# EAGLE design Base-Shield-v2 (EAGLE 6.4)
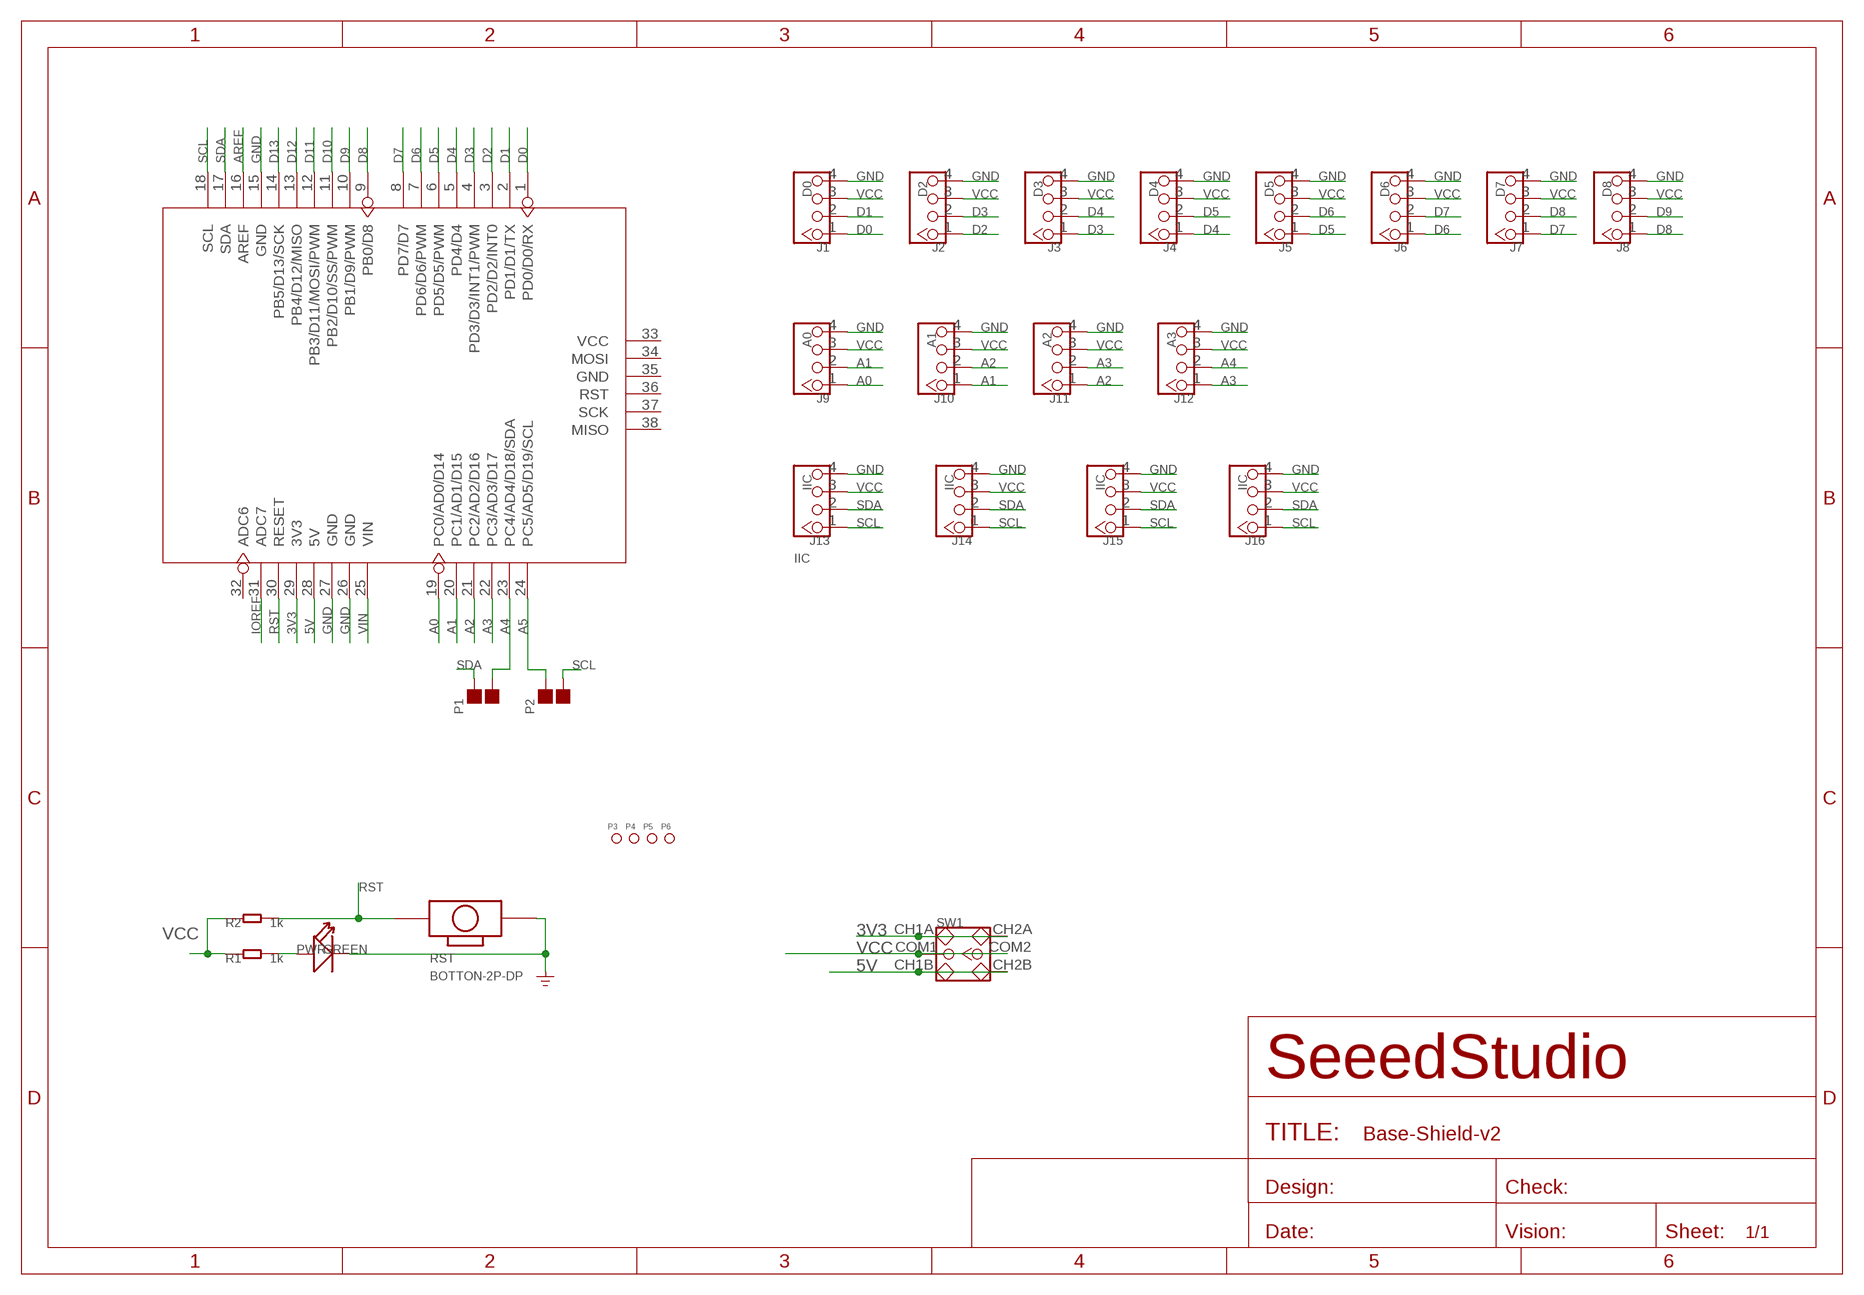
[diagram p0: schematic, sheet 1]

## Parts
J1  D0  TWIG-4P-2.0-2.0  [4P-2.0]
J2  D2  TWIG-4P-2.0-2.0  [4P-2.0]
J3  D3  TWIG-4P-2.0-2.0  [4P-2.0]
J4  D4  TWIG-4P-2.0-2.0  [4P-2.0]
J5  D5  TWIG-4P-2.0-2.0  [4P-2.0]
J6  D6  TWIG-4P-2.0-2.0  [4P-2.0]
J7  D7  TWIG-4P-2.0-2.0  [4P-2.0]
J8  D8  TWIG-4P-2.0-2.0  [4P-2.0]
J9  A0  TWIG-4P-2.0'90D'  [4P-2.0-90D]
J10  A1  TWIG-4P-2.0'90D'  [4P-2.0-90D]
J11  A2  TWIG-4P-2.0'90D'  [4P-2.0-90D]
J12  A3  TWIG-4P-2.0'90D'  [4P-2.0-90D]
J13  IIC  TWIG-4P-2.0-2.0  [4P-2.0]
J14  IIC  TWIG-4P-2.0-2.0  [4P-2.0]
J15  IIC  TWIG-4P-2.0-2.0  [4P-2.0]
J16  IIC  TWIG-4P-2.0-2.0  [4P-2.0]
P1  DNP  PAD-JUMPER-2P  [2P-SMD-1.78X1.27]
P2  DNP  PAD-JUMPER-2P  [2P-SMD-1.78X1.27]
P3  PAD-MARK  [ROUND-MARK-1.0]
P4  PAD-MARK  [ROUND-MARK-1.0]
P5  PAD-MARK  [ROUND-MARK-1.0]
P6  PAD-MARK  [ROUND-MARK-1.0]
PWR  GREEN  LED-3MM  [LED-2P-2.54-3MM]
R1  1k  R-0603  [R0603]
R2  1k  R-0603  [R0603]
RST  BOTTON-2P-DP  BOTTON-2P-90  [2P-7.62X3.56-90D]
SW1  SWITCH-2CH-6P'90D'  [6P-2CH-2.5-9.1X3.5X3.2H-90D]
U2  DIP Long Blue Female Header  ARDUINO-38P  [ARDUINO-38P]

## Nets
3V3: SW1.CH1A SW1.CH2A U2.29(3V3)
5V: SW1.CH1B SW1.CH2B U2.28(5V)
A0: J9.1 U2.19(PC0/AD0/D14)
A1: J9.2 J10.1 U2.20(PC1/AD1/D15)
A2: J10.2 J11.1 U2.21(PC2/AD2/D16)
A3: J11.2 J12.1 U2.22(PC3/AD3/D17)
A4: J12.2 P1.1 U2.23(PC4/AD4/D18/SDA)
A5: P2.2 U2.24(PC5/AD5/D19/SCL)
AREF: U2.16(AREF)
D0: J1.1 U2.1(PD0/D0/RX)
D1: J1.2 U2.2(PD1/D1/TX)
D2: J2.1 U2.3(PD2/D2/INT0)
D3: J2.2 J3.1 U2.4(PD3/D3/INT1/PWM)
D4: J3.2 J4.1 U2.5(PD4/D4)
D5: J4.2 J5.1 U2.6(PD5/D5/PWM)
D6: J5.2 J6.1 U2.7(PD6/D6/PWM)
D7: J6.2 J7.1 U2.8(PD7/D7)
D8: J7.2 J8.1 U2.9(PB0/D8)
D9: J8.2 U2.10(PB1/D9/PWM)
D10: U2.11(PB2/D10/SS/PWM)
D11: U2.12(PB3/D11/MOSI/PWM)
D12: U2.13(PB4/D12/MISO)
D13: U2.14(PB5/D13/SCK)
GND: J1.4 J2.4 J3.4 J4.4 J5.4 J6.4 J7.4 J8.4 J9.4 J10.4 J11.4 J12.4 J13.4 J14.4 J15.4 J16.4 PWR.K(-) RST.P$2 U2.15(GND) U2.26(GND) U2.27(GND)
IOREF: U2.31(ADC7)
N$1: PWR.A(+) R1.2
RST: R2.2 RST.P$1 U2.30(RESET)
SCL: J13.1 J14.1 J15.1 J16.1 P2.1 U2.18(SCL)
SDA: J13.2 J14.2 J15.2 J16.2 P1.2 U2.17(SDA)
VCC: J1.3 J2.3 J3.3 J4.3 J5.3 J6.3 J7.3 J8.3 J9.3 J10.3 J11.3 J12.3 J13.3 J14.3 J15.3 J16.3 R1.1 R2.1 SW1.COM1 SW1.COM2
VIN: U2.25(VIN)
Unconnected: U2.32(ADC6) U2.33(VCC) U2.34(MOSI) U2.35(GND) U2.36(RST) U2.37(SCK) U2.38(MISO)

## Notes on the sheet
- IIC

## Library data of the parts
J1-J16 = Connector:TWIG-4P-2.0
P1 P2 = Discrete:PAD-JUMPER-2P; PARTNO: DNP
P3-P6 = Discrete:PAD-MARK; PARTNO: DNP
PWR = Discrete:LED*
R1 R2 = Discrete:R*
RST = Discrete:BOTTON-2P
SW1 = Discrete:SWITCH-2CH-6P
U2 = moudle:ARDUINO-38P

## Net classes
0 default: width 0.203 mm, drill 0.305 mm, clearance 0.152 mm
3 usbvcc: width 0.203 mm, drill 0.305 mm, clearance 0.203 mm

## Board
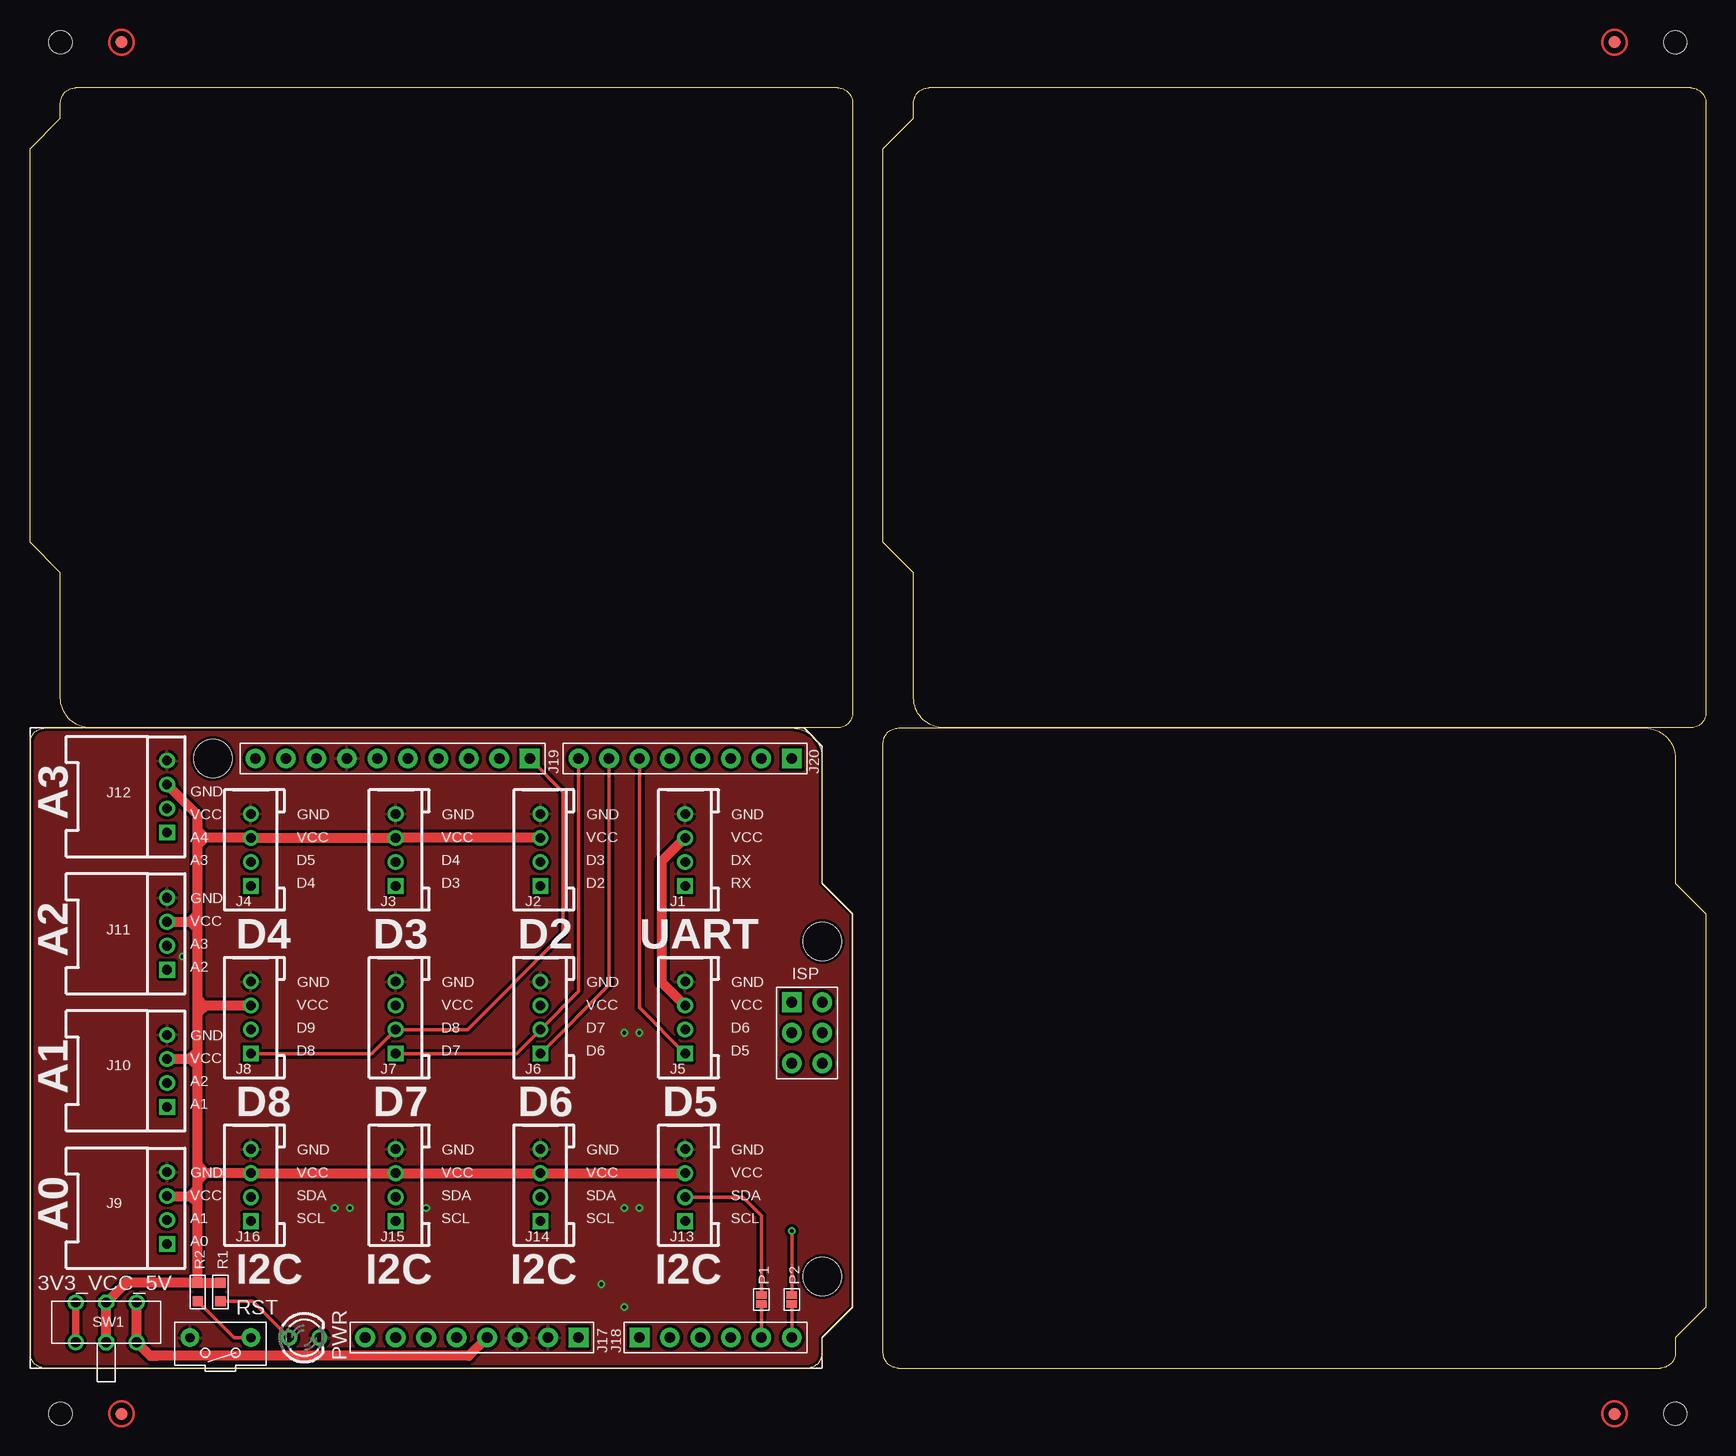
[diagram p1: board, top side]
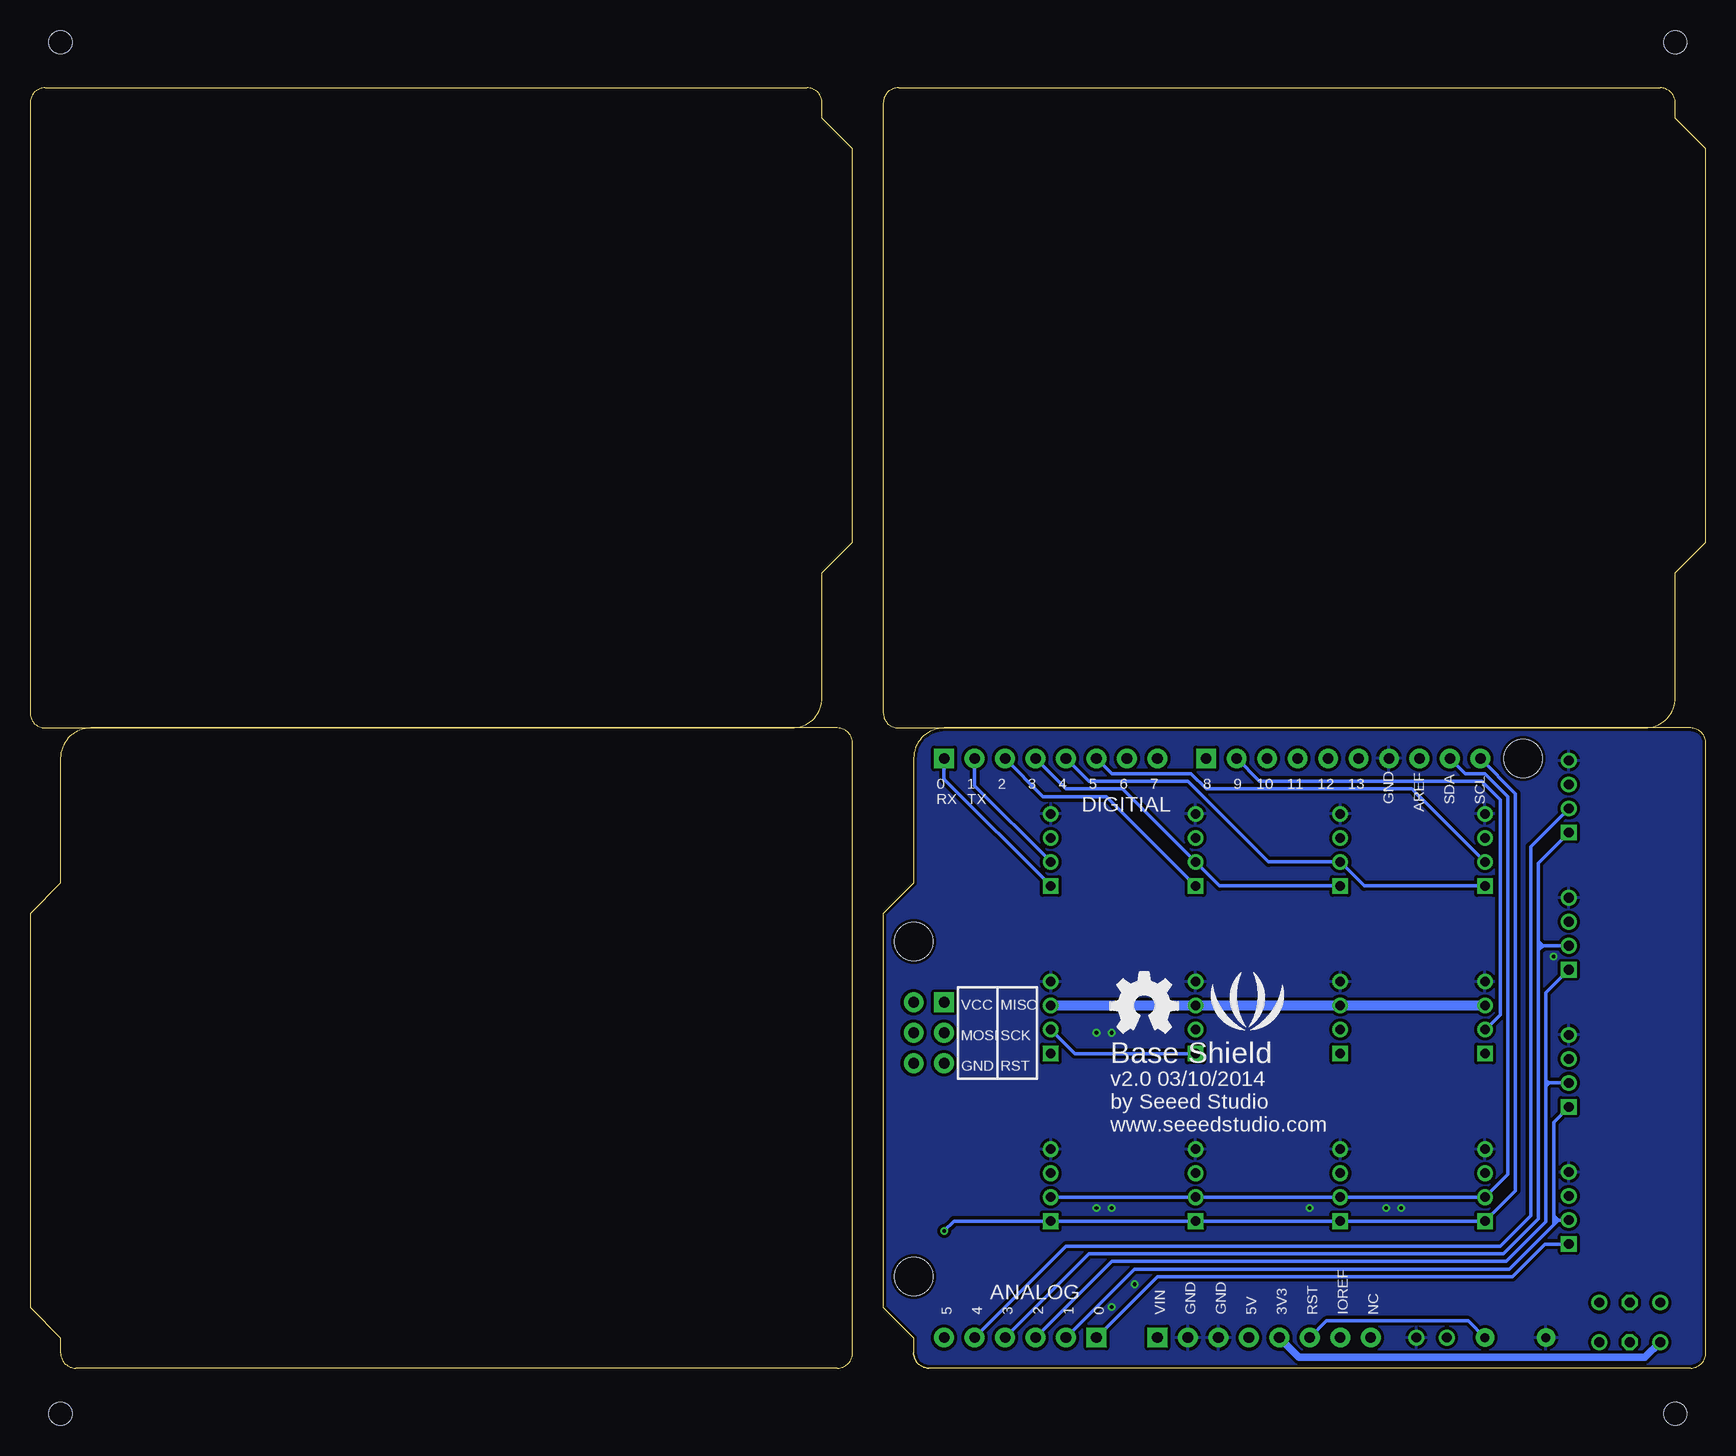
[diagram p2: board, bottom side, seen from below]

Size 139.7 x 106.68 mm. Coordinates in mm from the lower left corner, seen from the top.
Outline: 64.77,0 arc90 66.04,1.27
Outline: 1.27,0 arc-90 0,1.27
Outline: 0,52.07 arc-90 1.27,53.34
Outline: 63.5,53.34 arc-90 66.04,50.8
Outline: 66.04,1.27 66.04,2.54 68.58,5.08 68.58,37.85 66.04,40.39 66.04,50.8
Outline: 66.04,1.27 arc-90 64.77,0
Outline: 1.27,0 arc-90 0,1.27
Outline: 0,1.27 0,52.07
Outline: 0,52.07 arc-90 1.27,53.34
Outline: 1.27,53.34 63.5,53.34
Outline: 63.5,53.34 arc-90 66.04,50.8
Outline: 1.27,0 64.77,0
Outline: 137.16,2.54 137.16,1.27 arc-90 135.89,0 72.39,0 arc-90 71.12,1.27 71.12,52.07 arc-90 72.39,53.34 134.62,53.34 arc-90 137.16,50.8 137.16,40.39 139.7,37.85 139.7,5.08 137.16,2.54
Outline: 73.66,104.14 73.66,105.41 arc-90 74.93,106.68 138.43,106.68 arc-90 139.7,105.41 139.7,54.61 arc-90 138.43,53.34 76.2,53.34 arc-90 73.66,55.88 73.66,66.29 71.12,68.83 71.12,101.6 73.66,104.14
Outline: 2.54,104.14 2.54,105.41 arc-90 3.81,106.68 67.31,106.68 arc-90 68.58,105.41 68.58,54.61 arc-90 67.31,53.34 5.08,53.34 arc-90 2.54,55.88 2.54,66.29 0,68.83 0,101.6 2.54,104.14
Copper layers (1*16): Top 0.035mm / dielectric 1.5mm / Bottom 0.035mm
Design rules "SeeedStudio_rule_no_angle_090911 *": minimum track width 6mil, minimum drill 12mil, track to track 6mil, track to pad 6mil, pad to pad 6mil, via to via 6mil, smd to smd 0mil, copper to edge 10mil, drill to drill 10mil, minimum pad ring 10mil, minimum via ring 6mil, stop-mask expansion 2mil, vias tented up to drill 100mil, thermal gap 10mil
Holes 1.91 mm at 2.54,-3.81 137.16,-3.81 137.16,110.49 2.54,110.49

### Footprints (pad centres in the part's own frame; a part is rotated, then mirrored left to right if it is on the bottom)
4P-2.0 = drill 0.8 pad 1.27 square: 1 -3,0 | drill 0.8 pad 1.27: 2 -1,0; 3 1,0; 4 3,0
4P-2.0-90D = drill 0.8 pad 1.27 square: 1 -3,0 | drill 0.8 pad 1.27: 2 -1,0; 3 1,0; 4 3,0
2P-SMD-1.78X1.27 = smd 0.889 x 0.61: 1 0,0.381; 2 0,-0.381
ROUND-MARK-1.0 = smd 1.016 x 1.016: P$1 0,0
LED-2P-2.54-3MM = drill 0.813: A -1.27,0; K 1.27,0
R0603 = smd 0.889 x 0.889: 1 -0.762,0; 2 0.762,0
2P-7.62X3.56-90D = drill 0.762 pad 1.524: P$1 0,2.54; P$2 0,-2.54
6P-2CH-2.5-9.1X3.5X3.2H-90D = drill 0.813 pad 1.27: CH1A -2.54,-1.65; CH1B 2.54,-1.65; CH2A -2.54,1.65; CH2B 2.54,1.65 | drill 0.813 pad 1.27 octagon: COM1 0,-1.65; COM2 0,1.65
ARDUINO-38P = drill 0.889 pad 1.651 square: 1 63.5,50.8; 9 41.656,50.8; 19 50.8,2.54; 25 45.72,2.54; 38 63.5,30.48 | drill 0.889 pad 1.651: 2 60.96,50.8; 3 58.42,50.8; 4 55.88,50.8; 5 53.34,50.8; 6 50.8,50.8; 7 48.26,50.8; 8 45.72,50.8; 10 39.116,50.8; 11 36.576,50.8; 12 34.036,50.8; 13 31.496,50.8; 14 28.956,50.8; 15 26.416,50.8; 16 23.876,50.8; 17 21.336,50.8; 18 18.796,50.8; 20 53.34,2.54; 21 55.88,2.54; 22 58.42,2.54; 23 60.96,2.54; 24 63.5,2.54; 26 43.18,2.54; 27 40.64,2.54; 28 38.1,2.54; 29 35.56,2.54; 30 33.02,2.54; 31 30.48,2.54; 32 27.94,2.54; 33 66.04,30.48; 34 66.04,27.94; 35 66.04,25.4; 36 63.5,25.4; 37 63.5,27.94 | hole 3.2: 15.24,50.8; 66.04,35.56; 66.04,7.62

### Placement (x,y rotation side)
J1  54.61,43.18 90 top
J2  42.55,43.18 90 top
J3  30.48,43.18 90 top
J4  18.41,43.18 90 top
J5  54.61,29.21 90 top
J6  42.55,29.21 90 top
J7  30.48,29.21 90 top
J8  18.41,29.21 90 top
J9  11.43,13.34 90 top
J10  11.43,24.77 90 top
J11  11.43,36.2 90 top
J12  11.43,47.62 90 top
J13  54.61,15.24 90 top
J14  42.55,15.24 90 top
J15  30.48,15.24 90 top
J16  18.41,15.24 90 top
P1  60.96,5.71 180 top
P2  63.5,5.71 0 top
P3  7.62,-3.81 0 top  (outside the outline)
P4  132.08,-3.81 0 top  (outside the outline)
P5  7.62,110.49 0 top  (outside the outline)
P6  132.08,110.49 0 top  (outside the outline)
PWR  22.86,2.54 0 top
R1  15.88,6.35 270 top
R2  13.97,6.35 270 top
RST  15.88,2.54 270 top
SW1  6.35,3.81 0 top
U2  0,0 0 top
U$2  [OSHW_FILLX200_NOTEXT]  49.66,27.94 0 bottom
U$4  [LOGO_SILK]  38.23,29.84 0 bottom

### Tracks (layer width: path | path; a pad name or v marks a point on that pad's centre or on a via)
3V3
  Top 0.61: SW1.CH2A SW1.CH1A
  Bottom 0.61: SW1.CH1A 5.08,0.89 33.91,0.89 U2.29
5V
  Top 0.813: SW1.CH2B SW1.CH1B 10.03,1.02 10.29,1.02 10.53,1.02 36.58,1.02 U2.28
A0
  Bottom 0.305: J9.1 13.41,10.34 16.13,7.62 45.72,7.62 U2.19
A1
  Bottom 0.305: U2.20 47.62,8.26 16.38,8.26 12.7,11.94 | 12.7,11.94 12.7,12.32 | 12.7,12.7 12.7,20.5 J10.1 | J9.2 12.68,12.34 12.7,12.32 | 12.7,11.94 12.32,12.32 12.7,12.7 | 12.7,12.7 12.7,12.32
A2
  Bottom 0.305: U2.21 49.53,8.89 16.64,8.89 13.34,12.19 13.34,23.5 | 13.34,23.88 13.34,24 | 13.34,24 13.34,31.29 J11.1 | J10.2 13.06,23.77 | 13.1,23.77 13.22,23.77 13.34,23.88 | 13.06,23.77 13.1,23.77 | 13.1,23.77 13.34,24 | 13.06,23.77 13.34,23.5 | 13.34,23.5 13.34,23.88
A3
  Bottom 0.305: U2.22 51.44,9.53 16.89,9.53 13.97,12.45 13.97,34.8 | 13.97,34.8 13.97,35.18 | 13.97,35.56 13.97,42.09 J12.1 | J11.2 13.57,35.2 | 13.61,35.2 13.95,35.2 13.97,35.18 | 13.57,35.2 13.61,35.2 | 13.61,35.2 13.97,35.56 | 13.57,35.2 13.97,34.8 | 13.97,35.18 13.97,35.56
A4
  Top 0.305: U2.23 P1.1
  Bottom 0.305: U2.23 53.34,10.16 17.14,10.16 14.61,12.7 14.61,43.45 J12.2
A5
  Top 0.305: U2.24 P2.2
D0
  Bottom 0.305: U2.1 63.5,49.07 J1.1
D1
  Bottom 0.305: U2.2 60.96,48.53 J1.2
D2
  Bottom 0.305: U2.3 55.24,47.62 49.99,47.62 J2.1
D3
  Bottom 0.305: U2.4 53.34,48.26 48.62,48.26 J2.2 40.55,40.18 J3.1
D4
  Bottom 0.305: U2.5 51.44,48.9 43.18,48.9 36.47,42.18 J3.2 28.48,40.18 J4.1
D5
  Top 0.305: U2.6 50.8,30.02 J5.1
  Bottom 0.305: U2.6 49.53,49.53 42.93,49.53 41.66,48.26 24.51,48.26 23.88,47.62 23.86,47.62 J4.2
D6
  Top 0.305: U2.7 48.26,31.93 J6.1
  Bottom 0.305: J6.1 52.61,26.21 J5.2
D7
  Top 0.305: U2.8 45.72,31.39 J6.2 40.55,26.21 J7.1
D8
  Top 0.305: J8.1 28.48,26.21 J7.2 36.47,28.21 44.45,36.2 44.45,48.01 U2.9
D9
  Bottom 0.305: J8.2 17.14,29.46 17.14,47.37 18.67,48.9 37.21,48.9 U2.10
GND  (via drill 0.3 pad 0.64)
  other vias: 50.8,27.94 49.53,27.94 50.8,13.34 26.67,13.34 25.4,13.34 33.02,13.34 49.53,5.08 47.62,6.99 12.7,34.29 49.53,13.34
  pour Top (isolate 0.254): 0,53.34 68.58,53.34 68.58,0.13 68.58,0 0,0
  pour Bottom (isolate 0.254): 0,53.34 68.58,53.34 68.58,0.13 68.58,0 0,0
N$1
  Top 0.305: R1.2 18.54,5.59 PWR.A
RST
  Top 0.305: RST.P$1 17.02,2.54 R2.2
  Bottom 0.305: RST.P$1 19.81,3.94 31.62,3.94 U2.30
SCL  (via drill 0.3 pad 0.64)
  Top 0.305: v63.5,11.43 P2.1
  Bottom 0.305: U2.18 15.88,47.88 15.88,14.78 J16.1 J15.1 J14.1 J13.1 62.69,12.24 v63.5,11.43
SDA
  Top 0.305: P1.2 60.96,12.7 59.42,14.24 J13.2
  Bottom 0.305: J13.2 J14.2 J15.2 J16.2 16.51,16.14 16.51,47.62 18.41,49.53 20.07,49.53 U2.17
VCC
  Top 0.813: 13.97,13.72 13.97,7.24 14.1,7.11 | 13.97,14.35 13.97,14.99 | 13.97,14.99 13.97,15.62 | 13.97,15.62 13.97,16.26 | 13.97,16.64 13.97,25.15 | 13.97,25.15 13.97,25.91 | 13.97,26.04 13.97,29.59 | 13.97,29.59 13.97,30.48 | 13.97,30.73 13.97,36.58 | 13.97,37.08 13.97,37.85 | 13.97,37.85 13.97,43.56 | 13.97,44.32 13.97,44.83 | 13.97,44.83 13.97,46.09 J12.3 | 14.62,44.18 J4.3 J3.3 J2.3 | 14.59,44.18 14.11,44.18 13.97,44.32 | J11.3 13.32,37.2 | 13.35,37.2 13.86,37.2 13.97,37.08 | J8.3 14.59,30.21 | 14.49,30.21 14.24,30.21 13.97,30.48 | J10.3 13.32,25.77 | 13.35,25.77 13.83,25.77 13.97,25.91 | J9.3 13.32,14.34 | 13.35,14.34 13.95,14.34 13.97,14.35 | 14.62,16.24 J16.3 J15.3 J14.3 J13.3 | 14.59,16.24 13.99,16.24 13.97,16.26 | SW1.COM1 SW1.COM2 8,7.11 R2.1 | J5.3 52.7,32.12 52.7,42.27 J1.3 | 14.59,30.21 14.49,30.21 | 14.49,30.21 13.97,30.73 | 14.59,30.21 13.97,29.59 | 13.97,30.48 13.97,30.73 | 13.32,25.77 13.84,26.29 13.84,26.16 13.97,26.04 | 13.32,25.77 13.35,25.77 | 13.35,25.77 13.97,25.15 | 13.97,25.91 13.97,26.04 | 14.62,16.24 14.1,16.76 13.97,16.64 | 14.62,16.24 14.59,16.24 | 14.59,16.24 13.97,15.62 | 13.97,16.26 13.97,16.64 | 13.32,14.34 13.97,14.99 | 13.32,14.34 13.35,14.34 | 13.35,14.34 13.97,13.72 | 13.97,13.72 13.97,14.35 | 14.62,44.18 13.97,44.83 | 14.62,44.18 14.59,44.18 | 14.59,44.18 13.97,43.56 | 13.97,43.56 13.97,44.32 | 13.32,37.2 13.97,37.85 | 13.32,37.2 13.35,37.2 | 13.35,37.2 13.97,36.58 | 13.97,36.58 13.97,37.08 | R2.1 14.1,7.11 | 14.48,7.11 14.1,7.11 | R2.1 R1.1 | 13.46,7.11 R2.1
  Bottom 0.813: J8.3 J7.3 J6.3 J5.3

### Text on the board
tPlace: J19 | J20 | GND | A3 | VCC | GND | GND | GND | GND | A4 | VCC | VCC | VCC | VCC | A3 | D5 | D4 | D3 | DX | D4 | D3 | D2 | RX | GND | VCC | A3 | D4 | D3 | D2 | UART | A2 | A2 | GND | GND | GND | GND | ISP | VCC | VCC | VCC | VCC | D9 | D8 | D7 | D6 | GND | D8 | D7 | D6 | D5 | VCC | A1 | A2 | A1 | D8 | D7 | D6 | D5 | GND | GND | GND | GND | GND | VCC | VCC | VCC | VCC | VCC | SDA | SDA | SDA | SDA | A1 | SCL | SCL | SCL | SCL | A0 | A0 | I2C | I2C | I2C | I2C | 3V3_VCC_5V | J17 | J18
bPlace: 13 | 12 | 11 | 10 | 9 | 8 | 7 | 6 | 5 | 4 | 3 | 2 | 1 | 0 | SCL | SDA | GND | TX | RX | AREF | DIGITIAL | MISO | VCC | SCK | MOSI | Base Shield | RST | GND | v2.0 03/10/2014 | by Seeed Studio | www.seeedstudio.com | ANALOG | NC | IOREF | RST | 3V3 | 5V | GND | GND | VIN | 0 | 1 | 2 | 3 | 4 | 5
bPlate: A0 | A2 | A4 | SPI | UART